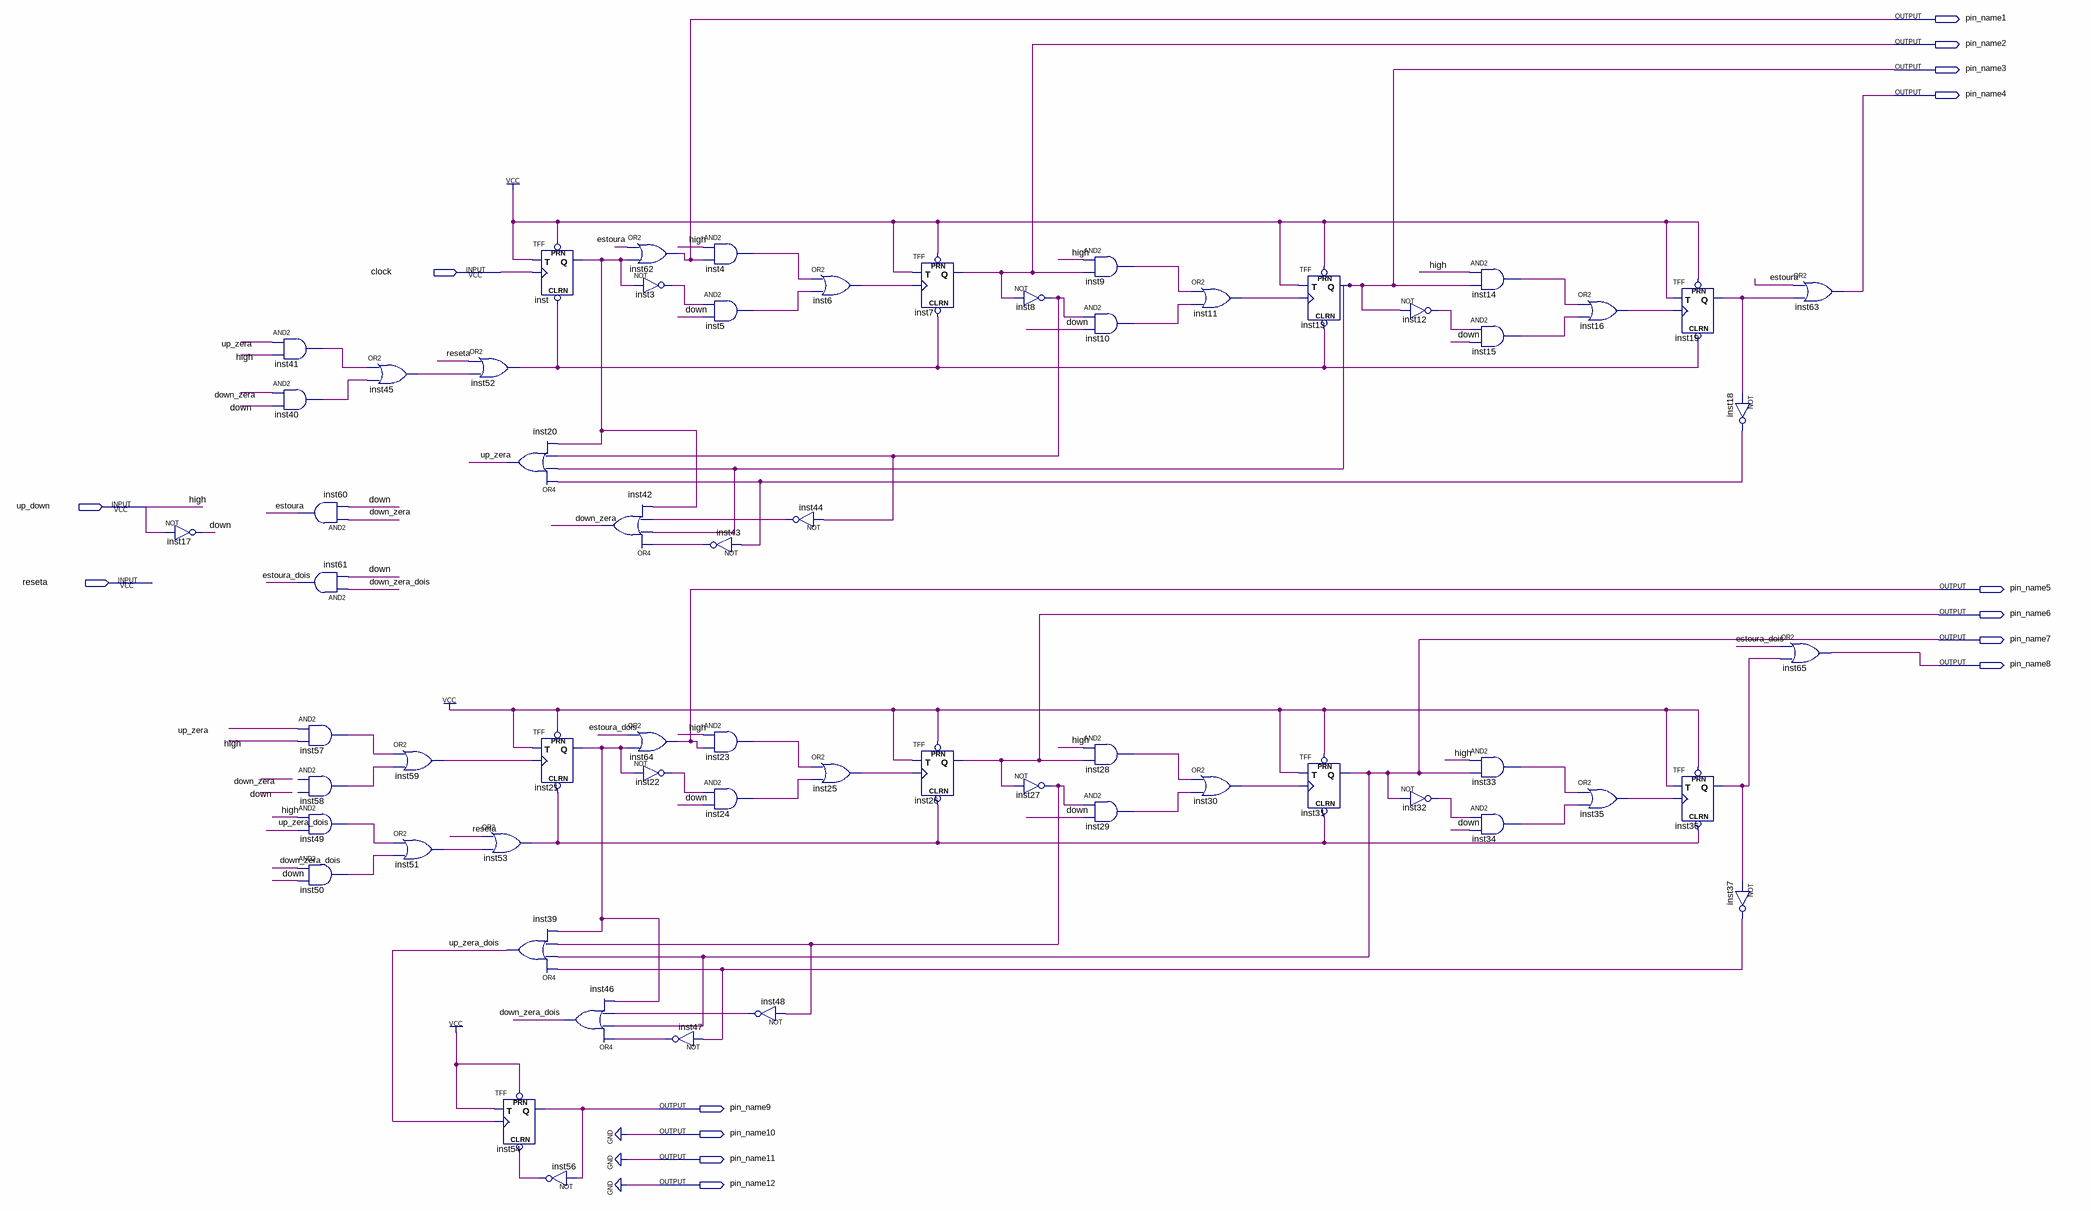
[diagram p0: schematic sheet]
// Quartus schematic Block1.bdf as structural Verilog: 62 symbols, 15 pins
module Block1 (
  input  clock,
  input  up_down,
  input  reseta,
  output pin_name1,
  output pin_name2,
  output pin_name3,
  output pin_name4,
  output pin_name5,
  output pin_name6,
  output pin_name7,
  output pin_name8,
  output pin_name9,
  output pin_name10,
  output pin_name11,
  output pin_name12
);

  wire down, down_zera, down_zera_dois, estoura, estoura_dois, inst3_out, inst4_out, inst5_out, inst6_out,
       inst8_out, inst9_out, inst10_out, inst11_out, inst12_out, inst14_out, inst15_out, inst16_out,
       inst18_out, inst19_q, inst21_q, inst22_out, inst23_out, inst24_out, inst25_out, inst27_out,
       inst28_out, inst29_out, inst30_out, inst32_out, inst33_out, inst34_out, inst35_out, inst36_q,
       inst37_out, inst40_out, inst41_out, inst43_out, inst44_out, inst45_out, inst47_out, inst48_out,
       inst49_out, inst50_out, inst51_out, inst52_out, inst53_out, inst56_out, inst57_out, inst58_out,
       inst59_out, inst_q, up_zera, up_zera_dois;

  not inst17 (down, up_down);
  and inst41 (inst41_out, up_zera, up_down);
  and inst40 (inst40_out, down_zera, down);
  and inst60 (estoura, down_zera, down);
  and inst61 (estoura_dois, down_zera_dois, down);
  and inst57 (inst57_out, up_zera, up_down);
  // AND2 inst58 has open pins: IN1=open, IN2=open, OUT=inst58_out
  and inst49 (inst49_out, up_down, up_zera_dois);
  and inst50 (inst50_out, down_zera_dois, down);
  or inst45 (inst45_out, inst41_out, inst40_out);
  or inst59 (inst59_out, inst57_out, inst58_out);
  or inst51 (inst51_out, inst49_out, inst50_out);
  or inst52 (inst52_out, reseta, inst45_out);
  or inst53 (inst53_out, reseta, inst51_out);
  TFF inst54 (.PRN(1'b1), .CLRN(inst56_out), .T(1'b1), .CLK(up_zera_dois), .Q(pin_name9));
  TFF inst (.PRN(1'b1), .CLRN(inst52_out), .T(1'b1), .CLK(clock), .Q(inst_q));
  or inst20 (up_zera, inst18_out, pin_name3, inst8_out, inst_q);
  TFF inst21 (.PRN(1'b1), .CLRN(inst53_out), .T(1'b1), .CLK(inst59_out), .Q(inst21_q));
  or inst39 (up_zera_dois, inst37_out, pin_name7, inst27_out, inst21_q);
  not inst56 (inst56_out, pin_name9);
  or inst42 (down_zera, inst43_out, pin_name3, inst44_out, inst_q);
  or inst46 (down_zera_dois, inst47_out, pin_name7, inst48_out, inst21_q);
  or inst62 (pin_name1, estoura, inst_q);
  not inst3 (inst3_out, inst_q);
  or inst64 (pin_name5, estoura_dois, inst21_q);
  not inst22 (inst22_out, inst21_q);
  and inst4 (inst4_out, up_down, pin_name1);
  and inst5 (inst5_out, inst3_out, down);
  not inst43 (inst43_out, inst18_out);
  and inst23 (inst23_out, up_down, pin_name5);
  and inst24 (inst24_out, inst22_out, down);
  not inst47 (inst47_out, inst37_out);
  not inst48 (inst48_out, inst27_out);
  not inst44 (inst44_out, inst8_out);
  or inst6 (inst6_out, inst4_out, inst5_out);
  or inst25 (inst25_out, inst23_out, inst24_out);
  TFF inst7 (.PRN(1'b1), .CLRN(inst52_out), .T(1'b1), .CLK(inst6_out), .Q(pin_name2));
  TFF inst26 (.PRN(1'b1), .CLRN(inst53_out), .T(1'b1), .CLK(inst25_out), .Q(pin_name6));
  not inst8 (inst8_out, pin_name2);
  not inst27 (inst27_out, pin_name6);
  and inst9 (inst9_out, up_down, pin_name2);
  and inst10 (inst10_out, inst8_out, down);
  and inst28 (inst28_out, up_down, pin_name6);
  and inst29 (inst29_out, inst27_out, down);
  or inst11 (inst11_out, inst9_out, inst10_out);
  or inst30 (inst30_out, inst28_out, inst29_out);
  TFF inst13 (.PRN(1'b1), .CLRN(inst52_out), .T(1'b1), .CLK(inst11_out), .Q(pin_name3));
  TFF inst31 (.PRN(1'b1), .CLRN(inst53_out), .T(1'b1), .CLK(inst30_out), .Q(pin_name7));
  not inst12 (inst12_out, pin_name3);
  not inst32 (inst32_out, pin_name7);
  and inst14 (inst14_out, up_down, pin_name3);
  and inst15 (inst15_out, inst12_out, down);
  and inst33 (inst33_out, up_down, pin_name7);
  and inst34 (inst34_out, inst32_out, down);
  or inst16 (inst16_out, inst14_out, inst15_out);
  or inst35 (inst35_out, inst33_out, inst34_out);
  TFF inst19 (.PRN(1'b1), .CLRN(inst52_out), .T(1'b1), .CLK(inst16_out), .Q(inst19_q));
  TFF inst36 (.PRN(1'b1), .CLRN(inst53_out), .T(1'b1), .CLK(inst35_out), .Q(inst36_q));
  not inst18 (inst18_out, inst19_q);
  not inst37 (inst37_out, inst36_q);
  or inst63 (pin_name4, estoura, inst19_q);
  or inst65 (pin_name8, estoura_dois, inst36_q);

  assign pin_name10 = 1'b0;
  assign pin_name11 = 1'b0;
  assign pin_name12 = 1'b0;

  // Other names for the same wires on the sheet: high = up_down
endmodule
